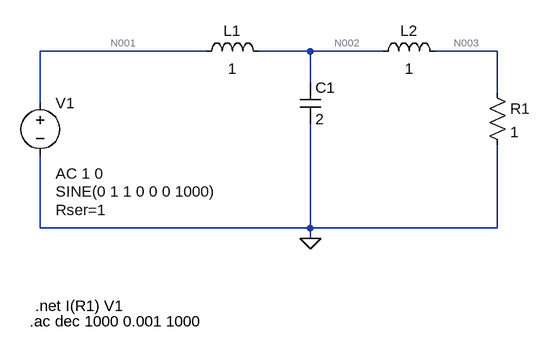
[diagram p0: schematic ts14.asc]
ts14.asc, the LTspice schematic file:
Version 4
SHEET 1 960 680
WIRE 336 32 80 32
WIRE 496 32 416 32
WIRE 608 32 496 32
WIRE 784 32 688 32
WIRE 496 80 496 32
WIRE 784 96 784 32
WIRE 80 112 80 32
WIRE 80 304 80 192
WIRE 496 304 496 144
WIRE 496 304 80 304
WIRE 784 304 784 176
WIRE 784 304 496 304
WIRE 496 320 496 304
FLAG 496 320 0
SYMBOL voltage 80 96 R0
WINDOW 3 24 152 Left 2
WINDOW 123 24 124 Left 2
WINDOW 39 24 180 Left 2
SYMATTR Value SINE(0 1 1 0 0 0 1000)
SYMATTR Value2 AC 1 0
SYMATTR SpiceLine Rser=1
SYMATTR InstName V1
SYMBOL ind 320 48 R270
WINDOW 0 32 56 VTop 2
WINDOW 3 5 56 VBottom 2
SYMATTR InstName L1
SYMATTR Value 1
SYMBOL cap 480 80 R0
SYMATTR InstName C1
SYMATTR Value 2
SYMBOL ind 592 48 R270
WINDOW 0 32 56 VTop 2
WINDOW 3 5 56 VBottom 2
SYMATTR InstName L2
SYMATTR Value 1
SYMBOL res 768 80 R0
SYMATTR InstName R1
SYMATTR Value 1
TEXT 72 424 Left 2 !.net I(R1) V1
TEXT 64 448 Left 2 !.ac dec 1000 0.001 1000

The netlist it stands for:
* ts14.asc
V1 N001 0 SINE(0 1 1 0 0 0 1000) AC 1 0 Rser=1
L1 N001 N002 1
C1 N002 0 2
L2 N002 N003 1
R1 N003 0 1
.net I(R1) V1
.ac dec 1000 0.001 1000
.backanno
.end

* Results of the author's LTspice run, read from the files saved beside the schematic
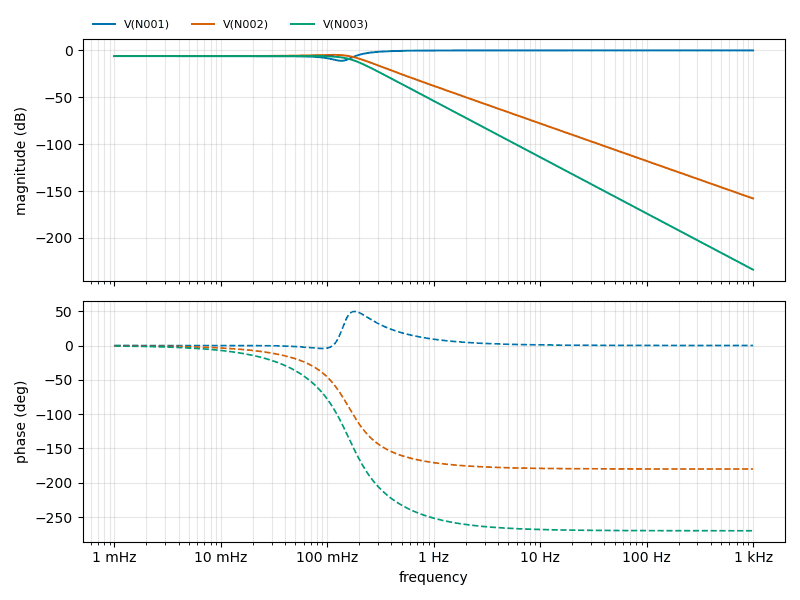
[diagram p1: AC Analysis of ts14.asc, plotted from the saved traces]
* AC Analysis, 1 run:
*   V(N001): -6.01 dB at 1 mHz, -0.00 dB at 1 kHz, peak -0.00 dB at 1 kHz, 3 dB below the peak at 231.4 mHz
*   V(N002): -6.02 dB at 1 mHz, -157.95 dB at 1 kHz, peak -4.78 dB at 112.5 mHz, 3 dB below the peak at 186 mHz
*   V(N003): -6.03 dB at 1 mHz, -233.91 dB at 1 kHz, peak -6.03 dB at 1 mHz, 3 dB below the peak at 159.1 mHz